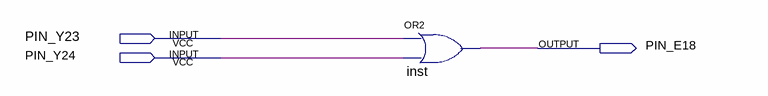
[diagram p0: schematic sheet]
// Quartus schematic Porta_OR.bdf as structural Verilog: 1 symbols, 3 pins
module Porta_OR (
  input  PIN_Y23,
  input  PIN_Y24,
  output PIN_E18
);

  or inst (PIN_E18, PIN_Y23, PIN_Y24);
endmodule
